# EAGLE design 2022国技館射出 (EAGLE 9.6.2)
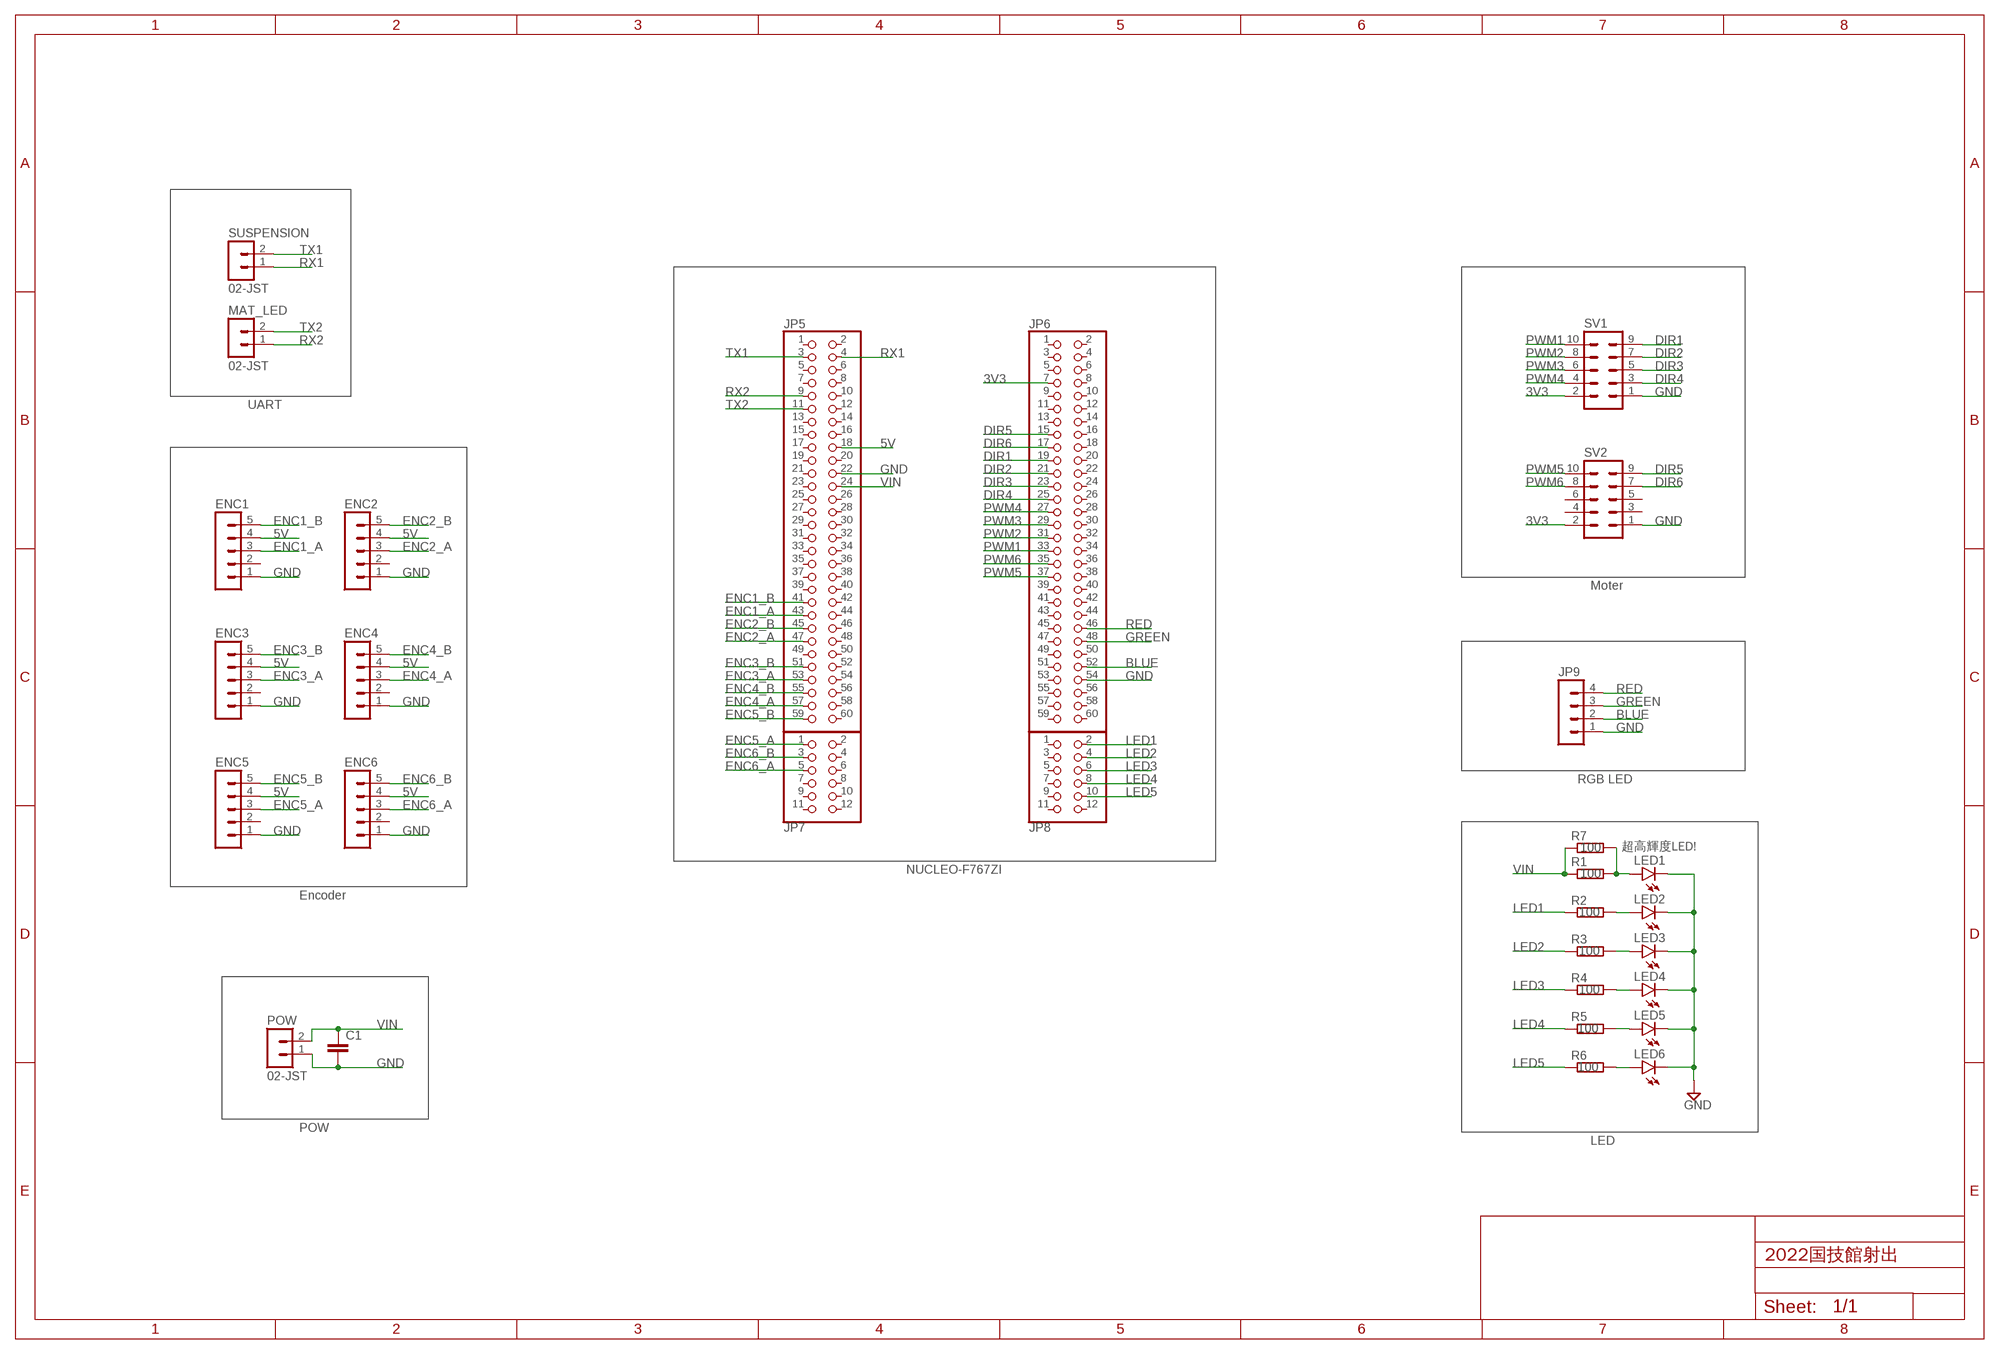
[diagram p0: schematic, sheet 1]

## Parts
C1  C-EU025-024X044  [C025-024X044]
ENC1  05-JST  [B5B-XH]
ENC2  05-JST  [B5B-XH]
ENC3  05-JST  [B5B-XH]
ENC4  05-JST  [B5B-XH]
ENC5  05-JST  [B5B-XH]
ENC6  05-JST  [B5B-XH]
JP5  PINHD-2X30  [2X30]
JP6  PINHD-2X30  [2X30]
JP7  PINHD-2X6  [2X06]
JP8  PINHD-2X6  [2X06]
JP9  04-JST  [B4B-XH]
LED1  LED5MM  [LED5MM]
LED2  LED5MM  [LED5MM]
LED3  LED5MM  [LED5MM]
LED4  LED5MM  [LED5MM]
LED5  LED5MM  [LED5MM]
LED6  LED5MM  [LED5MM]
MAT_LED  02-JST  [B2B-XH]
POW  02-JST  [B2B-XH]
R1  100  R-EU_0204/7  [0204/7]
R2  100  R-EU_0204/7  [0204/7]
R3  100  R-EU_0204/7  [0204/7]
R4  100  R-EU_0204/7  [0204/7]
R5  100  R-EU_0204/7  [0204/7]
R6  100  R-EU_0204/7  [0204/7]
R7  100  R-EU_0204/7  [0204/7]
SUSPENSION  02-JST  [B2B-XH]
SV1  ML10  [ML10]
SV2  ML10  [ML10]

## Nets
3V3: JP6.7 SV1.2 SV2.2
5V: ENC1.4 ENC2.4 ENC3.4 ENC4.4 ENC5.4 ENC6.4 JP5.18
BLUE: JP6.52 JP9.2
DIR1: JP6.19 SV1.9
DIR2: JP6.21 SV1.7
DIR3: JP6.23 SV1.5
DIR4: JP6.25 SV1.3
DIR5: JP6.15 SV2.9
DIR6: JP6.17 SV2.7
ENC1_A: ENC1.3 JP5.43
ENC1_B: ENC1.5 JP5.41
ENC2_A: ENC2.3 JP5.47
ENC2_B: ENC2.5 JP5.45
ENC3_A: ENC3.3 JP5.53
ENC3_B: ENC3.5 JP5.51
ENC4_A: ENC4.3 JP5.57
ENC4_B: ENC4.5 JP5.55
ENC5_A: ENC5.3 JP7.1
ENC5_B: ENC5.5 JP5.59
ENC6_A: ENC6.3 JP7.5
ENC6_B: ENC6.5 JP7.3
GND: C1.2 ENC1.1 ENC2.1 ENC3.1 ENC4.1 ENC5.1 ENC6.1 JP5.22 JP6.54 JP9.1 LED1.K(C) LED2.K(C) LED3.K(C) LED4.K(C) LED5.K(C) LED6.K(C) POW.1 SV1.1 SV2.1
GREEN: JP6.48 JP9.3
LED1: JP8.2 R2.1
LED2: JP8.4 R3.1
LED3: JP8.6 R4.1
LED4: JP8.8 R5.1
LED5: JP8.10 R6.1
N$1: LED1.A R1.2 R7.2
N$2: LED2.A R2.2
N$3: LED3.A R3.2
N$4: LED4.A R4.2
N$5: LED5.A R5.2
N$6: LED6.A R6.2
PWM1: JP6.33 SV1.10
PWM2: JP6.31 SV1.8
PWM3: JP6.29 SV1.6
PWM4: JP6.27 SV1.4
PWM5: JP6.37 SV2.10
PWM6: JP6.35 SV2.8
RED: JP6.46 JP9.4
RX1: JP5.4 SUSPENSION.1
RX2: JP5.9 MAT_LED.1
TX1: JP5.3 SUSPENSION.2
TX2: JP5.11 MAT_LED.2
VIN: C1.1 JP5.24 POW.2 R1.1 R7.1
Unconnected: ENC1.2 ENC2.2 ENC3.2 ENC4.2 ENC5.2 ENC6.2 JP5.1 JP5.2 JP5.5 JP5.6 JP5.7 JP5.8 JP5.10 JP5.12 JP5.13 JP5.14 JP5.15 JP5.16 JP5.17 JP5.19 JP5.20 JP5.21 JP5.23 JP5.25 JP5.26 JP5.27 JP5.28 JP5.29 JP5.30 JP5.31 JP5.32 JP5.33 JP5.34 JP5.35 JP5.36 JP5.37 JP5.38 JP5.39 JP5.40 JP5.42 JP5.44 JP5.46 JP5.48 JP5.49 JP5.50 JP5.52 JP5.54 JP5.56 JP5.58 JP5.60 JP6.1 JP6.2 JP6.3 JP6.4 JP6.5 JP6.6 JP6.8 JP6.9 JP6.10 JP6.11 JP6.12 JP6.13 JP6.14 JP6.16 JP6.18 JP6.20 JP6.22 JP6.24 JP6.26 JP6.28 JP6.30 JP6.32 JP6.34 JP6.36 JP6.38 JP6.39 JP6.40 JP6.41 JP6.42 JP6.43 JP6.44 JP6.45 JP6.47 JP6.49 JP6.50 JP6.51 JP6.53 JP6.55 JP6.56 JP6.57 JP6.58 JP6.59 JP6.60 JP7.2 JP7.4 JP7.6 JP7.7 JP7.8 JP7.9 JP7.10 JP7.11 JP7.12 JP8.1 JP8.3 JP8.5 JP8.7 JP8.9 JP8.11 JP8.12 SV2.3 SV2.4 SV2.5 SV2.6

## Notes on the sheet
- UART
- Moter
- RGB LED
- 超高輝度LED!
- NUCLEO-F767ZI
- Encoder
- POW
- LED

## Library data of the parts
C1 = rcl:C-EU: CAPACITOR, European symbol; SPICEPREFIX: C
ENC1-ENC6 = con-jst-xh:05-JST: JST CONNECTOR
JP5 JP6 = pinhead:PINHD-2X30: PIN HEADER
JP7 JP8 = pinhead:PINHD-2X6: PIN HEADER
JP9 = con-jst-xh:04-JST: JST CONNECTOR
LED1-LED6 = led:LED: LED OSRAM: - CHIPLED LG R971, LG N971, LY N971, LG Q971, LY Q971, LO R971, LY R971 LH N974, LH R974 LS Q976, LO Q976, LY Q976 LO Q996 - Hyper CHIPLED LW Q18S LB Q993, LB Q99A, LB R99A - SideLED LS A670, LO A670, LY A670, LG A670, LP A670 LB A673, LV A673, LT A673, LW A673 LH A674 LY A675 LS A676, LA A676, LO A676, LY A676, LW A676 LS A679, LY A679, LG A679 - Hyper Micro SIDELED® LS Y876, LA Y876, LO Y876, LY Y876 LT Y87S - SmartLED LW L88C, LW L88S LB L89C, LB L89S, LG L890 LS L89K, LO L89K, LY L89K LS L896, LA L896, LO L896, LY L896 - TOPLED LS T670, LO T670, LY T670, LG T670, LP T670 LSG T670, LSP T670, LSY T670, LOP T670, LYG T670 LG T671, LOG T671, LSG T671 LB T673, LV T673, LT T673, LW T673 LH T674 LS T676, LA T676, LO T676, LY T676, LB T676, LH T676, LSB T676, LW T676 LB T67C, LV T67C, LT T67C, LS T67K, LO T67K, LY T67K, LW E67C LS E67B, LA E67B, LO E67B, LY E67B, LB E67C, LV E67C, LT E67C LW T67C LS T679, LY T679, LG T679 LS T770, LO T770, LY T770, LG T770, LP T770 LB T773, LV T773, LT T773, LW T773 LH T774 LS E675, LA E675, LY E675, LS T675 LS T776, LA T776, LO T776, LY T776, LB T776 LHGB T686 LT T68C, LB T68C - Hyper Mini TOPLED® LB M676 - Mini TOPLED Santana® LG M470 LS M47K, LO M47K, LY M47K Source: http://www.osram.convergy.de LUXEON: - LUMILED® LXK2-PW12-R00, LXK2-PW12-S00, LXK2-PW14-U00, LXK2-PW14-V00 LXK2-PM12-R00, LXK2-PM12-S00, LXK2-PM14-U00 LXK2-PE12-Q00, LXK2-PE12-R00, LXK2-PE12-S00, LXK2-PE14-T00, LXK2-PE14-U00 LXK2-PB12-K00, LXK2-PB12-L00, LXK2-PB12-M00, LXK2-PB14-N00, LXK2-PB14-P00, LXK2-PB14-Q00 LXK2-PR12-L00, LXK2-PR12-M00, LXK2-PR14-Q00, LXK2-PR14-R00 LXK2-PD12-Q00, LXK2-PD12-R00, LXK2-PD12-S00 LXK2-PH12-R00, LXK2-PH12-S00 LXK2-PL12-P00, LXK2-PL12-Q00, LXK2-PL12-R00 Source: www.luxeon.com KINGBRIGHT: KA-3528ASYC Source: www.kingbright.com
MAT_LED POW SUSPENSION = con-jst-xh:02-JST: JST CONNECTOR
R1-R7 = rcl:R-EU_: RESISTOR, European symbol; SPICEPREFIX: R
SV1 SV2 = con-ml:ML10: HARTING; OC_FARNELL: unknown; OC_NEWARK: unknown

## Board
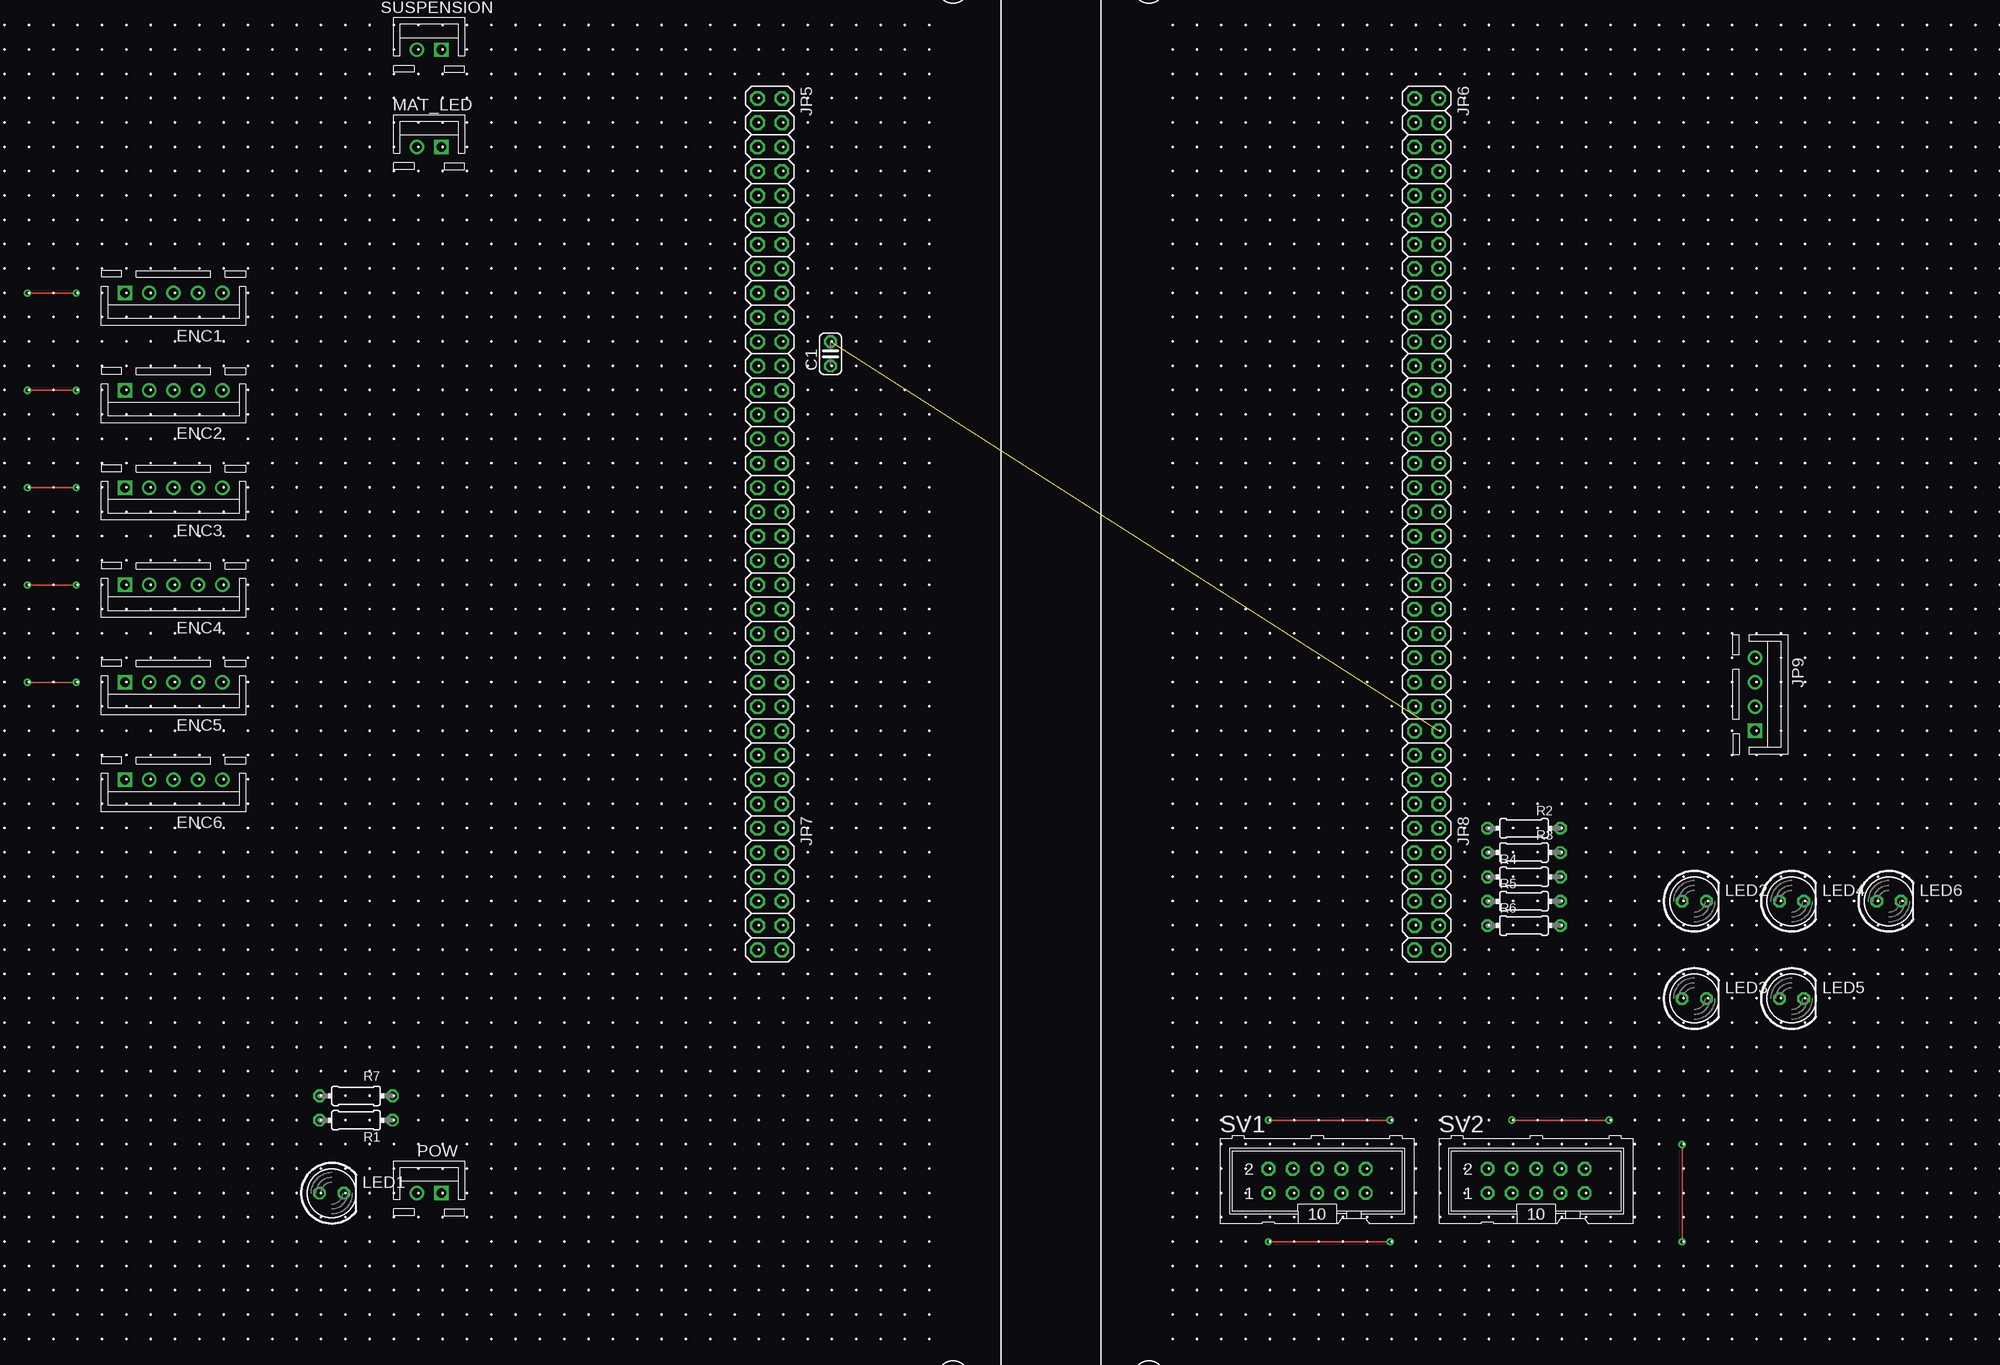
[diagram p1: board, top side]
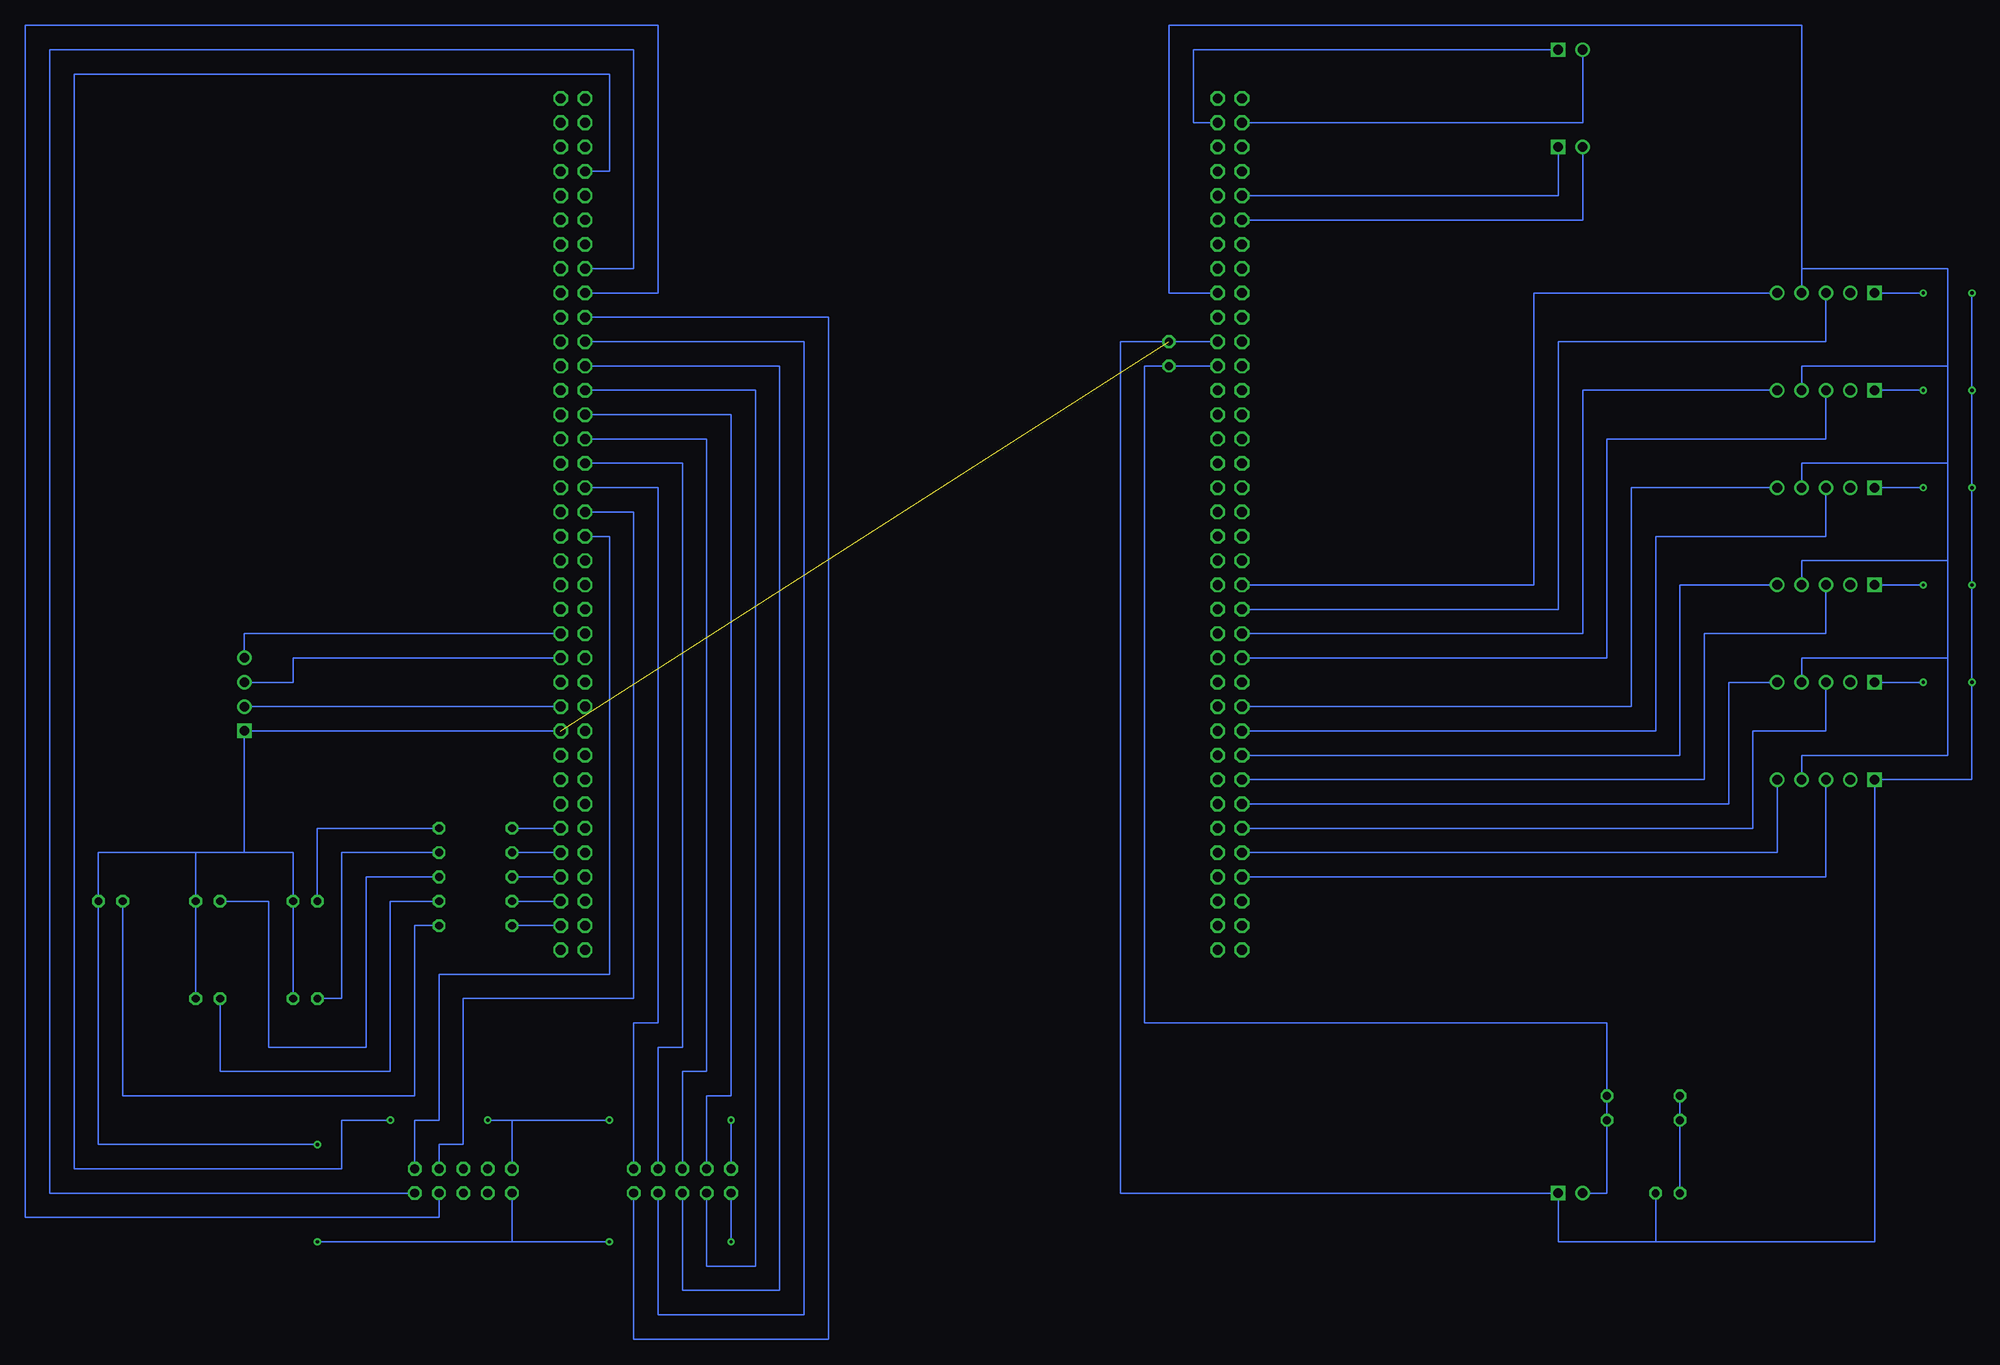
[diagram p2: board, bottom side, seen from below]

No outline drawn. Coordinates in mm, seen from the top.
Copper layers (1*16): Top 0.035mm / dielectric 1.5mm / Bottom 0.035mm
Design rules "default": minimum track width 6mil, minimum drill 0.35mm, track to track 6mil, track to pad 6mil, pad to pad 6mil, via to via 6mil, smd to smd 6mil, copper to edge 40mil, drill to drill 6mil, minimum pad ring 10mil, minimum via ring 8mil, stop-mask expansion 4mil, vias tented up to drill 0mil, thermal gap 10mil

### Footprints (pad centres in the part's own frame; a part is rotated, then mirrored left to right if it is on the bottom)
C025-024X044 = drill 0.813 octagon: 1 -1.27,0; 2 1.27,0
B5B-XH = drill 1 square: 1 5.08,0 | drill 1: 2 2.54,0; 3 0,0; 4 -2.54,0; 5 -5.08,0
2X30 = drill 1.016 octagon: 1 -38.1,-1.27; 2 -38.1,1.27; 3 -35.56,-1.27; 4 -35.56,1.27; 5 -33.02,-1.27; 6 -33.02,1.27; 7 -30.48,-1.27; 8 -30.48,1.27; 9 -27.94,-1.27; 10 -27.94,1.27; 11 -25.4,-1.27; 12 -25.4,1.27; 13 -22.86,-1.27; 14 -22.86,1.27; 15 -20.32,-1.27; 16 -20.32,1.27; 17 -17.78,-1.27; 18 -17.78,1.27; 19 -15.24,-1.27; 20 -15.24,1.27; 21 -12.7,-1.27; 22 -12.7,1.27; 23 -10.16,-1.27; 24 -10.16,1.27; 25 -7.62,-1.27; 26 -7.62,1.27; 27 -5.08,-1.27; 28 -5.08,1.27; 29 -2.54,-1.27; 30 -2.54,1.27; 31 0,-1.27; 32 0,1.27; 33 2.54,-1.27; 34 2.54,1.27; 35 5.08,-1.27; 36 5.08,1.27; 37 7.62,-1.27; 38 7.62,1.27; 39 10.16,-1.27; 40 10.16,1.27; 41 12.7,-1.27; 42 12.7,1.27; 43 15.24,-1.27; 44 15.24,1.27; 45 17.78,-1.27; 46 17.78,1.27; 47 20.32,-1.27; 48 20.32,1.27; 49 22.86,-1.27; 50 22.86,1.27; 51 25.4,-1.27; 52 25.4,1.27; 53 27.94,-1.27; 54 27.94,1.27; 55 30.48,-1.27; 56 30.48,1.27; 57 33.02,-1.27; 58 33.02,1.27; 59 35.56,-1.27; 60 35.56,1.27
2X06 = drill 1.016 octagon: 1 -6.35,-1.27; 2 -6.35,1.27; 3 -3.81,-1.27; 4 -3.81,1.27; 5 -1.27,-1.27; 6 -1.27,1.27; 7 1.27,-1.27; 8 1.27,1.27; 9 3.81,-1.27; 10 3.81,1.27; 11 6.35,-1.27; 12 6.35,1.27
B4B-XH = drill 1 square: 1 3.81,0 | drill 1: 2 1.27,0; 3 -1.27,0; 4 -3.81,0
LED5MM = drill 0.813 octagon: A -1.27,0; K 1.27,0
B2B-XH = drill 1 square: 1 1.27,0 | drill 1: 2 -1.27,0
0204/7 = drill 0.813 octagon: 1 -3.81,0; 2 3.81,0
ML10 = drill 0.914 octagon: 1 -5.08,-1.27; 2 -5.08,1.27; 3 -2.54,-1.27; 4 -2.54,1.27; 5 0,-1.27; 6 0,1.27; 7 2.54,-1.27; 8 2.54,1.27; 9 5.08,-1.27; 10 5.08,1.27

### Placement (x,y rotation side)
C1  96.52,111.76 90 top
ENC1  27.94,118.11 180 top
ENC2  27.94,107.95 180 top
ENC3  27.94,97.79 180 top
ENC4  27.94,87.63 180 top
ENC5  27.94,77.47 180 top
ENC6  27.94,67.31 180 top
JP5  90.17,100.33 270 top
JP6  158.75,100.33 270 top
JP7  90.17,55.88 270 top
JP8  158.75,55.88 270 top
JP9  193.04,76.2 270 top
LED1  44.45,24.13 0 top
LED2  186.69,54.61 0 top
LED3  186.69,44.45 0 top
LED4  196.85,54.61 0 top
LED5  196.85,44.45 0 top
LED6  207.01,54.61 0 top
MAT_LED  54.61,133.35 0 top
POW  54.61,24.13 0 top
R1  46.99,31.75 180 top
R2  168.91,62.23 0 top
R3  168.91,59.69 0 top
R4  168.91,57.15 0 top
R5  168.91,54.61 0 top
R6  168.91,52.07 0 top
R7  46.99,34.29 180 top
SUSPENSION  54.61,143.51 0 top
SV1  147.32,25.4 0 top
SV2  170.18,25.4 0 top
U$1  [TYPE.A]  114.3,0 90 top
U$2  [TYPE.A]  238.76,0 90 top

### Tracks (layer width: path | path; a pad name or v marks a point on that pad's centre or on a via)
3V3  (via drill 0.35)
  Top 0.152: v142.24,31.75 v154.94,31.75 | v177.8,31.75 v167.64,31.75
  Bottom 0.152: SV1.2 v142.24,31.75 | v154.94,31.75 165.1,31.75 | 165.1,31.75 SV2.2 | JP6.7 154.94,130.81 154.94,140.97 210.82,140.97 210.82,26.67 182.88,26.67 182.88,31.75 v177.8,31.75 | v167.64,31.75 165.1,31.75
5V
  Bottom 0.152: ENC6.4 30.48,69.85 15.24,69.85 15.24,80.01 | 15.24,80.01 30.48,80.01 ENC5.4 | 15.24,80.01 15.24,90.17 | 15.24,90.17 30.48,90.17 ENC4.4 | 15.24,90.17 15.24,100.33 | 15.24,100.33 30.48,100.33 ENC3.4 | 15.24,100.33 15.24,110.49 | 15.24,110.49 30.48,110.49 ENC2.4 | 15.24,110.49 15.24,120.65 30.48,120.65 | ENC1.4 30.48,120.65 | 30.48,120.65 30.48,146.05 96.52,146.05 96.52,118.11 JP5.18
BLUE
  Bottom 0.152: JP6.52 JP9.2
DIR1
  Bottom 0.152: SV1.9 152.4,8.89 132.08,8.89 132.08,115.57 JP6.19
DIR2
  Bottom 0.152: SV1.7 149.86,11.43 134.62,11.43 134.62,113.03 JP6.21
DIR3
  Bottom 0.152: SV1.5 147.32,13.97 137.16,13.97 137.16,110.49 JP6.23
DIR4
  Bottom 0.152: SV1.3 144.78,16.51 139.7,16.51 139.7,107.95 JP6.25
DIR5
  Bottom 0.152: SV2.9 213.36,24.13 213.36,143.51 152.4,143.51 152.4,120.65 JP6.15
DIR6
  Bottom 0.152: JP6.17 149.86,118.11 149.86,146.05 215.9,146.05 215.9,21.59 172.72,21.59 SV2.7
ENC1_A
  Bottom 0.152: ENC1.3 27.94,113.03 55.88,113.03 55.88,85.09 JP5.43
ENC1_B
  Bottom 0.152: JP5.41 58.42,87.63 58.42,118.11 ENC1.5
ENC2_A
  Bottom 0.152: ENC2.3 27.94,102.87 50.8,102.87 50.8,80.01 JP5.47
ENC2_B
  Bottom 0.152: JP5.45 53.34,82.55 53.34,107.95 ENC2.5
ENC3_A
  Bottom 0.152: JP5.53 45.72,72.39 45.72,92.71 27.94,92.71 ENC3.3
ENC3_B
  Bottom 0.152: ENC3.5 48.26,97.79 48.26,74.93 JP5.51
ENC4_A
  Bottom 0.152: JP5.57 40.64,67.31 40.64,82.55 27.94,82.55 ENC4.3
ENC4_B
  Bottom 0.152: ENC4.5 43.18,87.63 43.18,69.85 JP5.55
ENC5_A
  Bottom 0.152: JP7.1 35.56,62.23 35.56,72.39 27.94,72.39 ENC5.3
ENC5_B
  Bottom 0.152: ENC5.5 38.1,77.47 38.1,64.77 JP5.59
ENC6_A
  Bottom 0.152: JP7.5 27.94,57.15 ENC6.3
ENC6_B
  Bottom 0.152: ENC6.5 33.02,59.69 JP7.3
GND  (via drill 0.35)  (1 unrouted)
  Top 0.152: v17.78,118.11 v12.7,118.11 | v12.7,107.95 v17.78,107.95 | v12.7,97.79 v17.78,97.79 | v12.7,87.63 v17.78,87.63 | v12.7,77.47 v17.78,77.47 | v142.24,19.05 v154.94,19.05 | v185.42,29.21 v185.42,19.05
  Bottom 0.152: LED1.K 45.72,19.05 | 45.72,19.05 55.88,19.05 POW.1 101.6,24.13 101.6,113.03 C1.2 JP5.22 | 45.72,19.05 22.86,19.05 ENC6.1 12.7,67.31 v12.7,77.47 v12.7,87.63 v12.7,97.79 v12.7,107.95 v12.7,118.11 | ENC1.1 v17.78,118.11 | v17.78,107.95 ENC2.1 | v17.78,97.79 ENC3.1 | v17.78,87.63 ENC4.1 | v17.78,77.47 ENC5.1 | LED3.K LED2.K 187.96,59.69 193.04,59.69 | 193.04,59.69 198.12,59.69 | 198.12,59.69 LED4.K LED5.K | 198.12,59.69 208.28,59.69 LED6.K 208.28,29.21 v185.42,29.21 | 193.04,59.69 JP9.1 JP6.54 | SV1.1 v142.24,19.05 | v154.94,19.05 165.1,19.05 | 165.1,19.05 SV2.1 | v185.42,19.05 165.1,19.05
GREEN
  Bottom 0.152: JP6.48 187.96,80.01 187.96,77.47 JP9.3
LED1
  Bottom 0.152: R2.1 JP8.2
LED2
  Bottom 0.152: R3.1 JP8.4
LED3
  Bottom 0.152: JP8.6 R4.1
LED4
  Bottom 0.152: JP8.8 R5.1
LED5
  Bottom 0.152: JP8.10 R6.1
N$1
  Bottom 0.152: R7.2 R1.2 LED1.A
N$2
  Bottom 0.152: LED2.A 185.42,62.23 R2.2
N$3
  Bottom 0.152: LED3.A 182.88,44.45 182.88,59.69 R3.2
N$4
  Bottom 0.152: LED4.A 190.5,54.61 190.5,39.37 180.34,39.37 180.34,57.15 R4.2
N$5
  Bottom 0.152: LED5.A 195.58,36.83 177.8,36.83 177.8,54.61 R5.2
N$6
  Bottom 0.152: R6.2 175.26,52.07 175.26,34.29 205.74,34.29 LED6.A
PWM1
  Bottom 0.152: JP6.33 149.86,97.79 149.86,41.91 152.4,41.91 SV1.10
PWM2
  Bottom 0.152: JP6.31 147.32,100.33 147.32,39.37 149.86,39.37 SV1.8
PWM3
  Bottom 0.152: JP6.29 144.78,102.87 144.78,36.83 147.32,36.83 SV1.6
PWM4
  Bottom 0.152: JP6.27 142.24,105.41 142.24,34.29 144.78,34.29 SV1.4
PWM5
  Bottom 0.152: JP6.37 154.94,92.71 154.94,46.99 172.72,46.99 172.72,31.75 175.26,31.75 SV2.10
PWM6
  Bottom 0.152: SV2.8 172.72,29.21 170.18,29.21 170.18,44.45 152.4,44.45 152.4,95.25 JP6.35
RED
  Bottom 0.152: JP9.4 193.04,82.55 JP6.46
RX1
  Bottom 0.152: SUSPENSION.1 93.98,143.51 93.98,135.89 JP5.4
RX2
  Bottom 0.152: MAT_LED.1 55.88,128.27 JP5.9
TX1
  Bottom 0.152: SUSPENSION.2 53.34,135.89 JP5.3
TX2
  Bottom 0.152: MAT_LED.2 53.34,125.73 JP5.11
VIN
  Bottom 0.152: POW.2 50.8,24.13 R1.1 R7.1 50.8,41.91 99.06,41.91 99.06,110.49 C1.1 JP5.24